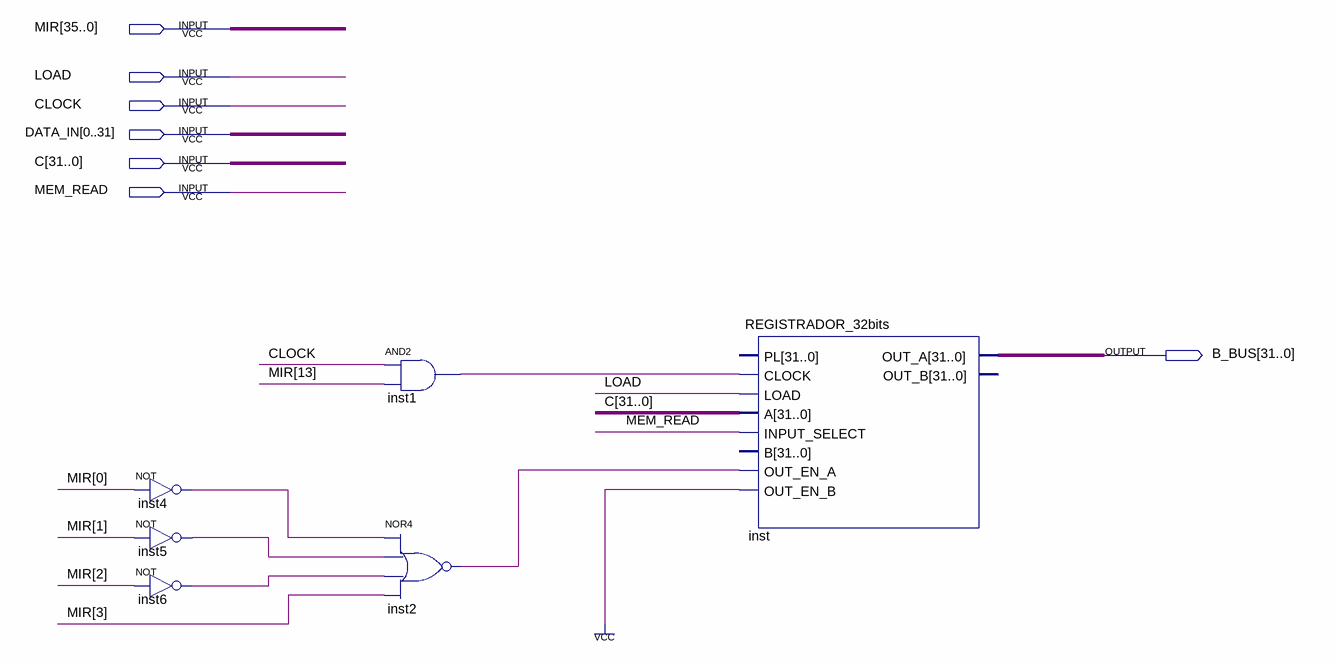
[diagram p0: schematic sheet]
// Quartus schematic TOS.bdf as structural Verilog: 6 symbols, 7 pins
module TOS (
  input  [35:0] MIR,
  input  LOAD,
  input  CLOCK,
  input  [0:31] DATA_IN,
  input  [31:0] C,
  input  MEM_READ,
  output [31:0] B_BUS
);

  wire inst1_out, inst2_out, inst4_out, inst5_out, inst6_out;

  not inst4 (inst4_out, MIR[0]);
  not inst5 (inst5_out, MIR[1]);
  not inst6 (inst6_out, MIR[2]);
  and inst1 (inst1_out, CLOCK, MIR[13]);
  nor inst2 (inst2_out, inst4_out, inst5_out, inst6_out, MIR[3]);
  REGISTRADOR_32bits inst (
    .CLOCK(inst1_out), .LOAD(LOAD), .A(C), .INPUT_SELECT(MEM_READ), .OUT_EN_A(inst2_out), .OUT_EN_B(1'b1),
    .OUT_A(B_BUS));  // open: PL, B, OUT_B
endmodule
